# Altium schematic sheet modulo_extension_schdoc.SchDoc: Modulo de Extensiones
size 193 x 292 mm; CheckedBy: Santiago Millicay; Author: Diego Coll; DocumentNumber: 1; Revision: 0.0.0; SheetNumber: 1; SheetTotal: 1; Organization: Altium Limited; Address1: L3, 12a Rodborough Rd; Address2: Frenchs Forest; Address3: NSW; Address4: Australia 2086
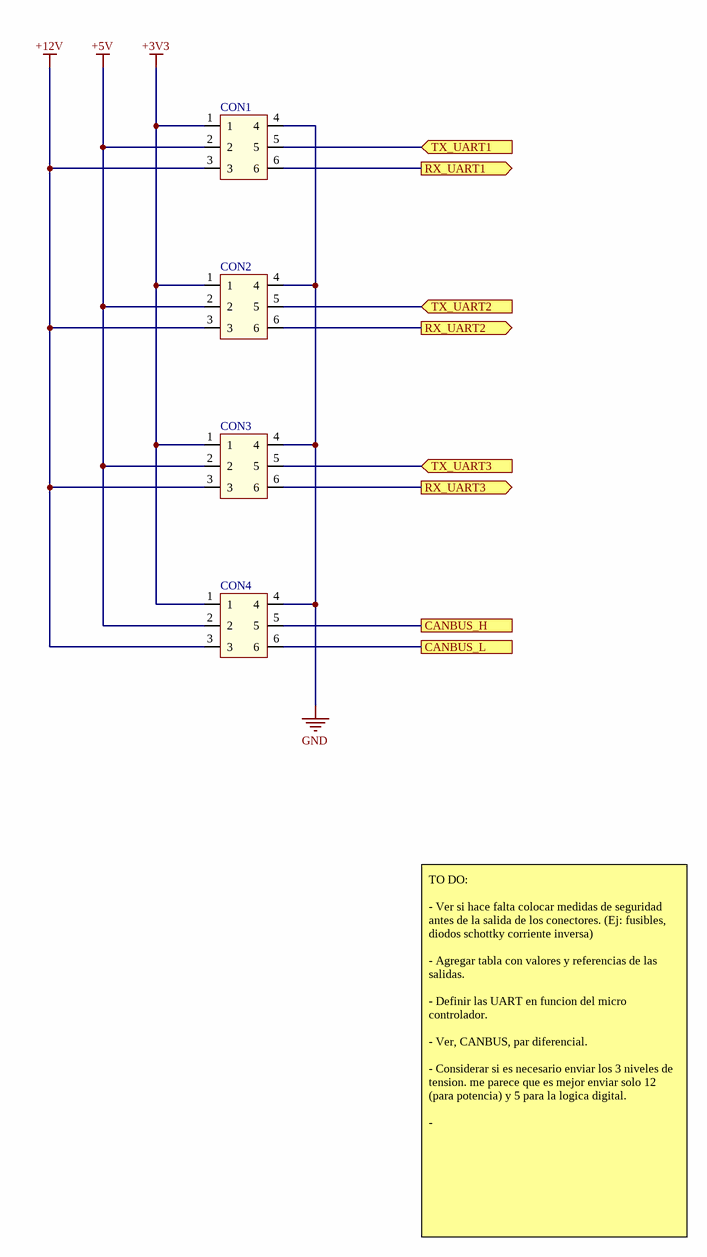
[diagram p0: modulo_extension_schdoc.SchDoc]

## Parts
CON1  CONN_HEADER_RA_6POS  [CONN_HEADER_RA_6POS]  (value not drawn)
CON2  CONN_HEADER_RA_6POS  [CONN_HEADER_RA_6POS]  (value not drawn)
CON3  CONN_HEADER_RA_6POS  [CONN_HEADER_RA_6POS]  (value not drawn)
CON4  CONN_HEADER_RA_6POS  [CONN_HEADER_RA_6POS]  (value not drawn)

## Ports
CANBUS_H, CANBUS_L, RX_UART1 (out), RX_UART2 (out), RX_UART3 (out), TX_UART1 (in), TX_UART2 (in), TX_UART3 (in)

## Nets
+3V3: CON1.1 CON2.1 CON3.1 CON4.1
+5V: CON1.2 CON2.2 CON3.2 CON4.2
+12V: CON1.3 CON2.3 CON3.3 CON4.3
GND: CON1.4 CON2.4 CON3.4 CON4.4
CANBUS_H: CON4.5 ; port CANBUS_H
CANBUS_L: CON4.6 ; port CANBUS_L
RX_UART1: CON1.6 ; port RX_UART1
RX_UART2: CON2.6 ; port RX_UART2
RX_UART3: CON3.6 ; port RX_UART3
TX_UART1: CON1.5 ; port TX_UART1
TX_UART2: CON2.5 ; port TX_UART2
TX_UART3: CON3.5 ; port TX_UART3

## Notes on the sheet
- TO DO:
  - Ver si hace falta colocar medidas de seguridad antes de la salida de los conectores. (Ej: fusibles, diodos schottky corriente inversa)
  - Agregar tabla con valores y referencias de las salidas.
  - Definir las UART en funcion del micro controlador.
  - Ver, CANBUS, par diferencial.
  - Considerar si es necesario enviar los 3 niveles de tension. me parece que es mejor enviar solo 12 (para potencia) y 5 para la logica digital.
  -
- Título:
- Autor:
- Tamaño:
- Número:
- Fecha:
- A4
- Revisión:
- Hoja:
- Hora:
- de
- Revisado por:

## Library data of the parts
CON1-CON4 = CONN_HEADER_RA_6POS: Conector hembra de 6 posiciones molex; Manufacturer Part Number: 45732-0001; Voltage Rating: 600V; Current Rating: 8A; Gender: Male; Number of Contacts: 6; Pitch: 4.2mm; Contact Material: Brass; Contact Plating: Tin; Housing Material: Thermoplastic; Manufacturer: Molex; Max Operating Temperature: 105°C; Min Operating Temperature: -40°C; Mount: Through Hole; Number of Positions: 6; Number of Rows: 2; Orientation: Right Angle; Package Quantity: 300; Packaging: Tray; Radiation Hardening: No; Row Spacing: 4.2mm; Termination: Solder; Category: Headers and Wire Housings